# Altium schematic sheet Soic8Pads.SchDoc
size Letter
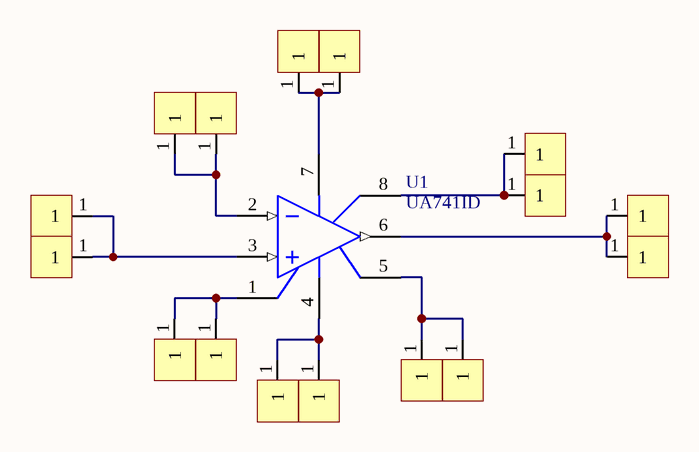
[diagram p0: Soic8Pads.SchDoc]

## Parts
U1  UA741ID  [SO8_N]
V5  VIA40mil80mil  [VIA40mil80mil]  (value not drawn)
V6  VIA40mil80mil  [VIA40mil80mil]  (value not drawn)
V9  VIA40mil80mil  [VIA40mil80mil]  (value not drawn)
V10  VIA40mil80mil  [VIA40mil80mil]  (value not drawn)
V13  VIA40mil80mil  [VIA40mil80mil]  (value not drawn)
V15  VIA40mil80mil  [VIA40mil80mil]  (value not drawn)
V17  VIA40mil80mil  [VIA40mil80mil]  (value not drawn)
V18  VIA40mil80mil  [VIA40mil80mil]  (value not drawn)
V21  VIA40mil80mil  [VIA40mil80mil]  (value not drawn)
V22  VIA40mil80mil  [VIA40mil80mil]  (value not drawn)
V25  VIA40mil80mil  [VIA40mil80mil]  (value not drawn)
V26  VIA40mil80mil  [VIA40mil80mil]  (value not drawn)
V29  VIA40mil80mil  [VIA40mil80mil]  (value not drawn)
V30  VIA40mil80mil  [VIA40mil80mil]  (value not drawn)
V33  VIA40mil80mil  [VIA40mil80mil]  (value not drawn)
V34  VIA40mil80mil  [VIA40mil80mil]  (value not drawn)

## Nets
NetU1_1: U1.1(OS_NULL) V25.1 V26.1
NetU1_2: U1.2(IN-) V9.1 V10.1
NetU1_3: U1.3(IN+) V17.1 V21.1
NetU1_4: U1.4(V-) V33.1 V34.1
NetU1_5: U1.5(OS_NULL) V29.1 V30.1
NetU1_6: U1.6(OUT) V18.1 V22.1
NetU1_7: U1.7(V+) V5.1 V6.1
NetU1_8: U1.8(NC) V13.1 V15.1

## Library data of the parts
U1 = UA741ID: General-Purpose Single Operational Amplifier; Published: 24-Aug-2001; LatestRevisionDate: 13-Apr-2006; LatestRevisionNote: IPC-7351 Footprint Added.; DatasheetVersion: Oct-1997; PackageVersion: Dec-2002; PackageReference: SO8; Publisher: Altium Limited; PackageDescription: 8-Pin Small Outline Integrated Circuit 1.27 mm Pitch; Code_JEDEC: MS-012-AA; Code_IPC: SOIC127P600-8; ComponentLink1Description: Manufacturer Link; ComponentLink1URL: http://www.st.com/; ComponentLink2Description: Datasheet; ComponentLink2URL: http://www.st.com/stonline/products/literature/ds/5304/ua741.pdf